# EAGLE design color_sensor (EAGLE 6.5.0)
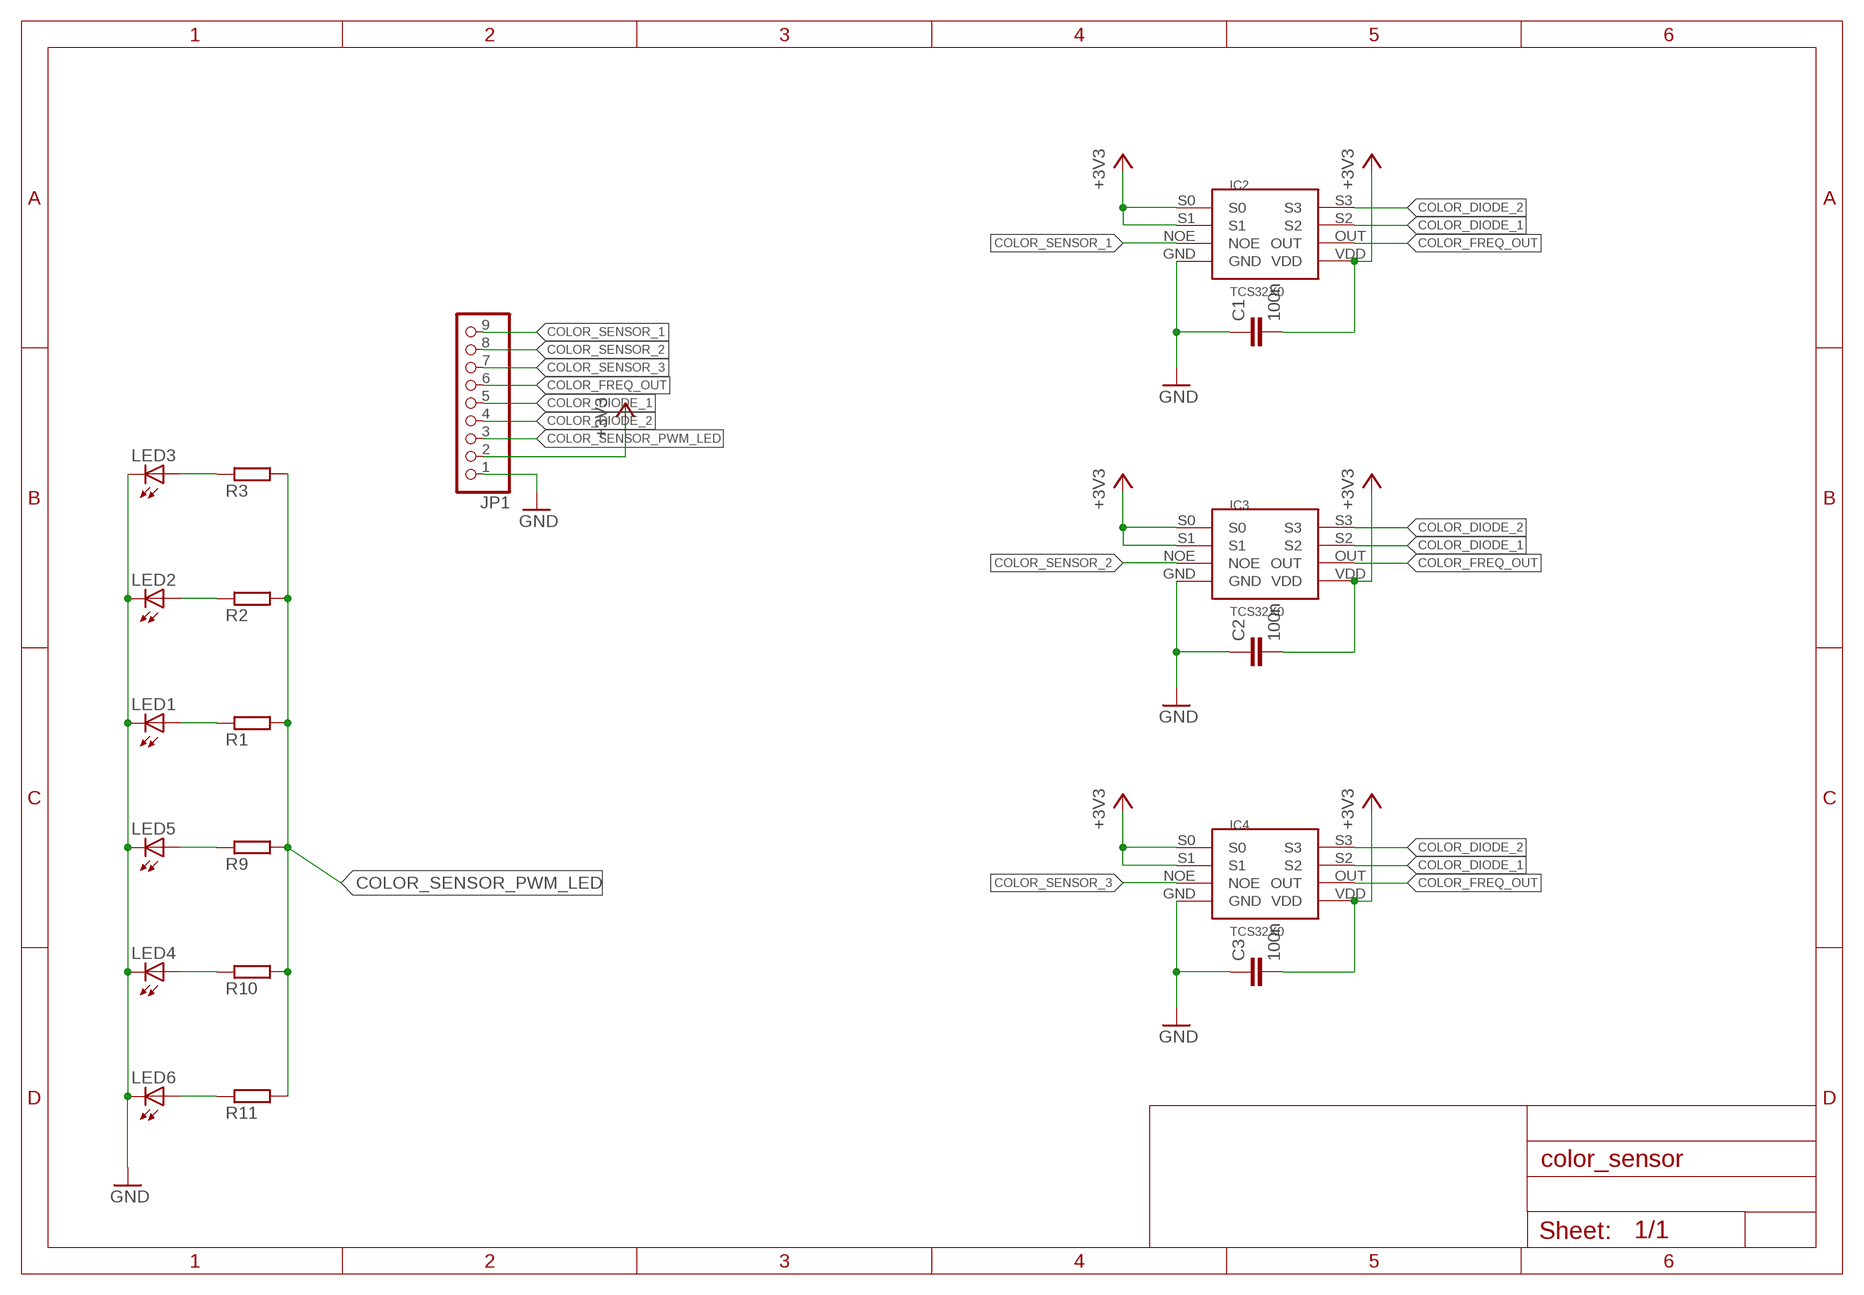
[diagram p0: schematic, sheet 1]

## Parts
C1  100n  C-EUC0805  [C0805]
C2  100n  C-EUC0805  [C0805]
C3  100n  C-EUC0805  [C0805]
IC2  TCS32X0  [TCS32X0]
IC3  TCS32X0  [TCS32X0]
IC4  TCS32X0  [TCS32X0]
JP1  PINHD-1X9  [1X09]
LED1  NFSG036BT  [NFSG036BT]
LED2  NFSG036BT  [NFSG036BT]
LED3  NFSG036BT  [NFSG036BT]
LED4  NFSG036BT  [NFSG036BT]
LED5  NFSG036BT  [NFSG036BT]
LED6  NFSG036BT  [NFSG036BT]
R1  R-EU_M0805  [M0805]
R2  R-EU_M0805  [M0805]
R3  R-EU_M0805  [M0805]
R9  R-EU_M0805  [M0805]
R10  R-EU_M0805  [M0805]
R11  R-EU_M0805  [M0805]

## Nets
+3V3: C1.2 C2.2 C3.2 IC2.S0 IC2.S1 IC2.VDD IC3.S0 IC3.S1 IC3.VDD IC4.S0 IC4.S1 IC4.VDD JP1.2
COLOR_DIODE_1: IC2.S2 IC3.S2 IC4.S2 JP1.5
COLOR_DIODE_2: IC2.S3 IC3.S3 IC4.S3 JP1.4
COLOR_FREQ_OUT: IC2.OUT IC3.OUT IC4.OUT JP1.6
COLOR_SENSOR_1: IC2.NOE JP1.9
COLOR_SENSOR_2: IC3.NOE JP1.8
COLOR_SENSOR_3: IC4.NOE JP1.7
COLOR_SENSOR_PWM_LED: JP1.3 R1.2 R2.2 R3.2 R9.2 R10.2 R11.2
GND: C1.1 C2.1 C3.1 IC2.GND IC3.GND IC4.GND JP1.1 LED1.C LED2.C LED3.C LED4.C LED5.C LED6.C
N$1: LED1.A R1.1
N$2: LED2.A R2.1
N$3: LED3.A R3.1
N$17: LED5.A R9.1
N$18: LED4.A R10.1
N$19: LED6.A R11.1

## Library data of the parts
C1-C3 = rcl:C-EU: CAPACITOR, European symbol
IC2-IC4 = BEEP:TCS32X0
JP1 = pinhead:PINHD-1X9: PIN HEADER
LED1-LED6 = led:NFSG036BT: CHIP TYPE GREEN LED NFSx036xT Source: NICHIA CORPORATION .. NFSG036BT-E.pdf
R1-R3 R9-R11 = rcl:R-EU_: RESISTOR, European symbol

## Board
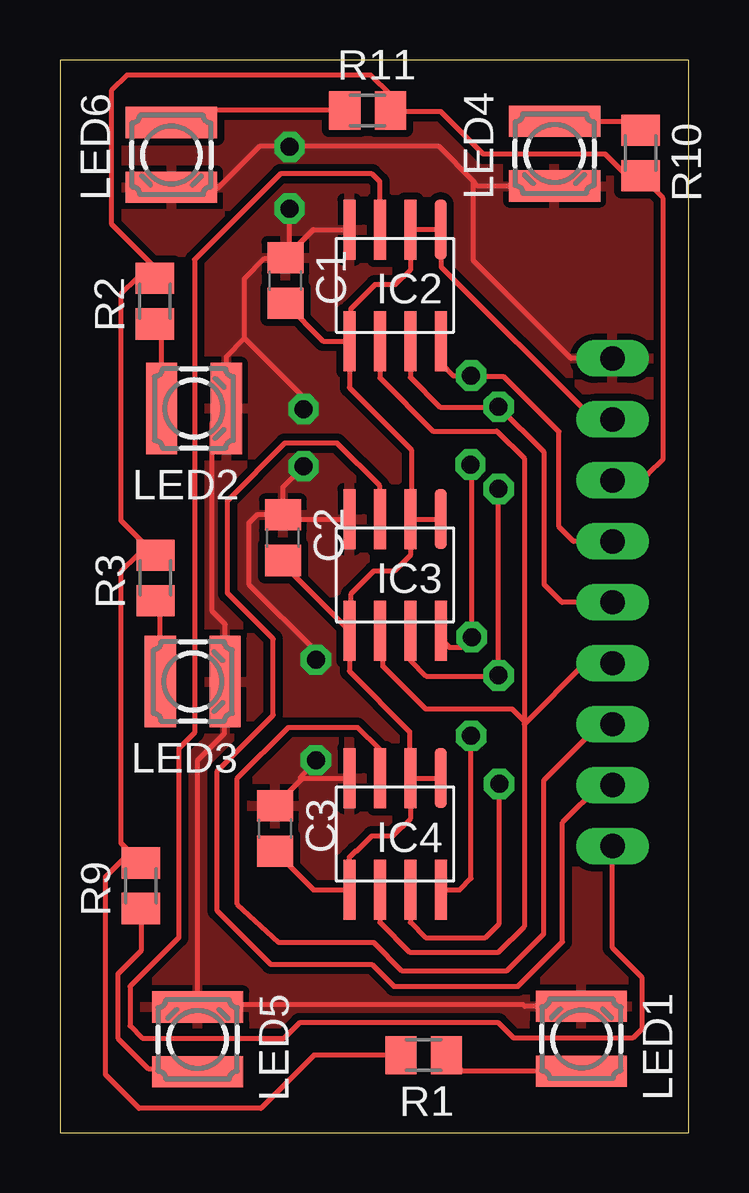
[diagram p1: board, top side]
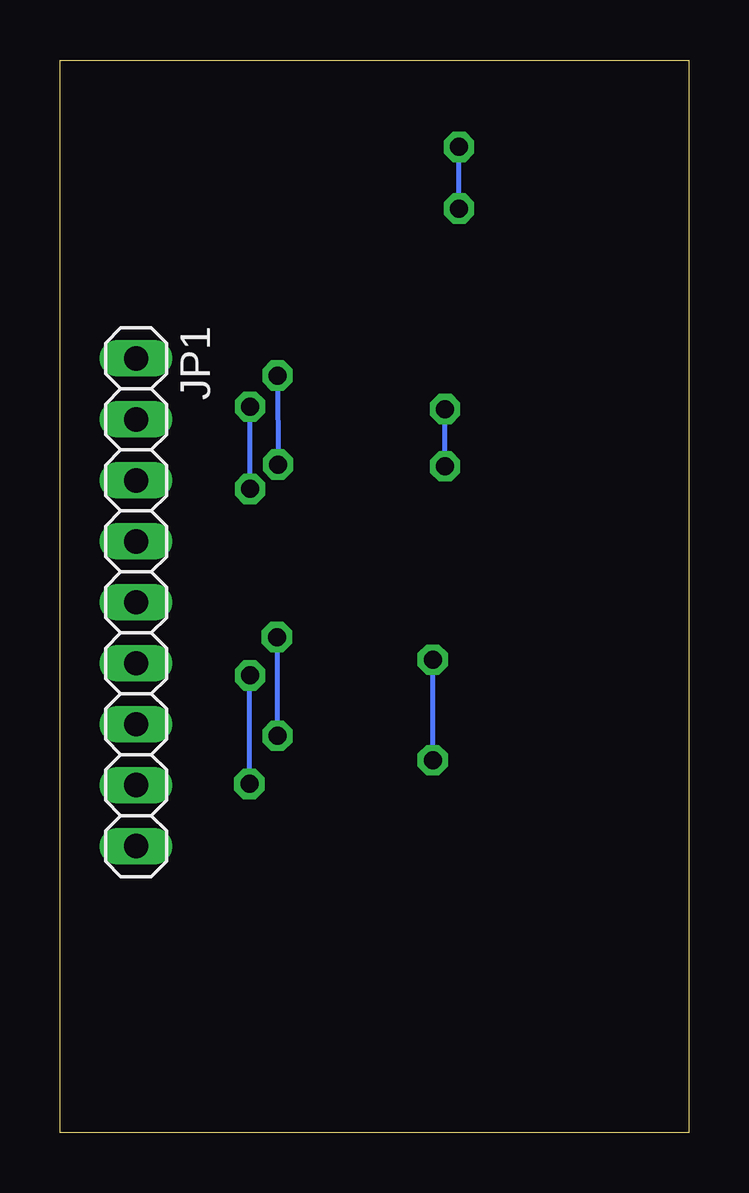
[diagram p2: board, bottom side, seen from below]

Size 26.21 x 44.69 mm. Coordinates in mm from the lower left corner, seen from the top.
Outline: 0,0 26.21,0 26.21,44.69 0,44.69 0,0
Copper layers (1*16): Top 0.035mm / dielectric 1.5mm / Bottom 0.035mm
Design rules "default *": minimum track width 8mil, minimum drill 0.75mm, track to track 8mil, track to pad 8mil, pad to pad 8mil, via to via 8mil, smd to smd 8mil, copper to edge 20mil, drill to drill 8mil, minimum pad ring 10mil, minimum via ring 10mil, stop-mask expansion 4mil, vias tented up to drill 0mil, thermal gap 10mil

### Footprints (pad centres in the part's own frame; a part is rotated, then mirrored left to right if it is on the bottom)
C0805 = smd 1.3 x 1.5: 1 -0.95,0; 2 0.95,0
TCS32X0 = smd 0.5 x 2.5: GND 1.905,-2.325; NOE 0.635,-2.325; OUT 0.635,2.325; S0 -1.905,-2.325; S1 -0.635,-2.325; S2 -0.635,2.325; S3 -1.905,2.325; VDD 1.905,2.325
1X09 = drill 1.016 long: 1 -10.16,0; 2 -7.62,0; 3 -5.08,0; 4 -2.54,0; 5 0,0; 6 2.54,0; 7 5.08,0; 8 7.62,0; 9 10.16,0
NFSG036BT = smd 1.3 x 3.8: A 1.35,0; C -1.35,0
M0805 = smd 1.3 x 1.6: 1 -0.95,0; 2 0.95,0

### Placement (x,y rotation side)
C1  9.4,35.51 270 top
C2  9.3,24.79 270 top
C3  8.97,12.67 270 top
IC2  13.97,35.31 180 top
IC3  13.97,23.24 180 top
IC4  13.97,12.45 180 top
JP1  23.04,22.1 270 bottom
LED1  21.74,3.91 270 top
LED2  5.59,30.18 180 top
LED3  5.54,18.8 180 top
LED4  20.62,40.79 90 top
LED5  5.74,3.89 270 top
LED6  4.65,40.74 90 top
R1  15.16,3.23 180 top
R2  3.96,34.65 90 top
R3  3.99,23.11 90 top
R9  3.38,10.29 90 top
R10  24.21,40.82 270 top
R11  12.83,42.6 0 top

### Tracks (layer width: path | path; a pad name or v marks a point on that pad's centre or on a via)
+3V3
  Top 0.203: IC2.VDD 12.06,31.04 14.66,28.45 14.66,25.62 IC3.S1 | IC3.S1 IC3.S0 | IC3.S1 14.61,24.05 13.95,23.39 13.08,23.39 12.12,22.43 12.12,20.97 IC3.VDD | IC3.VDD 12.06,19.23 14.58,16.71 14.58,14.8 IC4.S1 | IC4.S1 IC4.S0 | IC4.S1 14.63,14.75 14.63,13.11 13.89,12.37 13.01,12.37 12.37,11.73 12.32,11.73 12.06,11.48 IC4.VDD 10.57,10.12 C3.2 | C1.2 10.98,32.98 IC2.VDD | IC2.VDD 12.12,33.03 12.12,34.31 13.13,35.33 13.99,35.33 14.61,35.94 IC2.S1 IC2.S0 15.9,37.61 15.9,36.07 22.25,29.72 JP1.2 | C2.2 9.3,23.68 IC3.VDD
COLOR_DIODE_1  (via drill 0.75)
  Top 0.203: IC2.S2 14.61,31.47 15.85,30.23 18.26,30.23 v18.29,30.25 20.19,28.35 20.19,22.84 20.93,22.1 JP1.5 | IC3.S2 14.63,20.89 14.63,19.66 15.27,19.02 18.31,19.02 v18.29,19.05 v18.29,26.82 | IC4.S2 14.61,8.76 15.24,8.13 17.73,8.13 18.31,8.71 v18.31,14.53
  Bottom 0.203: v18.29,19.05 18.31,19.02 | 18.39,18.95 18.31,19.02 | v18.29,26.82 v18.29,30.25 | v18.31,14.53 18.31,19.02
COLOR_DIODE_2  (via drill 0.75)
  Top 0.203: IC2.S3 15.88,32.05 16.38,31.55 v17.14,31.55 17.2,31.5 18.52,31.5 20.8,29.21 20.8,25.25 21.41,24.64 JP1.4 | v17.12,27.84 17.17,27.84 v17.17,20.65 16.74,20.22 16.23,20.22 15.88,20.57 IC3.S3 | IC4.S3 16.67,10.12 17.14,10.59 v17.14,16.54
  Bottom 0.203: v17.14,31.55 v17.12,27.84 | v17.14,16.54 17.14,20.52 v17.17,20.65
COLOR_FREQ_OUT
  Top 0.203: IC2.OUT 13.34,31.45 15.54,29.23 18.21,29.23 19.36,28.09 19.36,17.14 | 19.36,17.14 19.36,17.02 | 19.36,17.02 19.36,8.58 18.29,7.52 14.58,7.52 13.34,8.76 IC4.OUT | IC3.OUT 13.46,20.79 13.46,19.43 15.24,17.65 18.85,17.65 19.36,17.14 | 19.36,17.02 21.89,19.56 JP1.6
COLOR_SENSOR_1
  Top 0.203: IC2.NOE 13.34,39.62 13.01,39.95 9.2,39.95 5.61,36.37 5.61,16.66 4.95,16 4.95,8.13 2.92,6.1 2.92,4.45 3.43,3.94 9.35,3.94 9.98,4.57 18.29,4.57 18.92,3.94 23.88,3.94 24.26,4.32 24.26,6.48 23.04,7.7 JP1.9
COLOR_SENSOR_2
  Top 0.203: IC3.NOE 13.34,26.95 11.56,28.73 9.37,28.73 6.99,26.34 6.99,22.48 8.89,20.57 8.89,17.4 6.55,15.06 6.55,9.25 8.79,7.01 13.01,7.01 13.92,6.1 19.1,6.1 20.95,7.95 20.95,12.93 22.5,14.48 JP1.8
COLOR_SENSOR_3
  Top 0.203: IC4.NOE 13.34,15.95 12.39,16.89 9.53,16.89 7.39,14.76 7.39,9.53 9.12,7.93 13.08,7.93 14.25,6.76 18.64,6.76 20.17,8.28 20.17,14.68 22.5,17.02 JP1.7
COLOR_SENSOR_PWM_LED
  Top 0.203: 2.93,11.69 2.54,12.07 2.54,23.37 3.24,24.06 R3.2 2.54,25.51 2.54,34.92 3.21,35.6 R2.2 3.96,36.04 2.16,37.85 2.16,43.43 2.79,44.07 12.95,44.07 13.78,43.25 R11.2 13.83,42.55 15.88,42.55 17.65,40.77 22.73,40.77 23.63,39.87 R10.2 25.15,38.93 25.15,28.07 24.51,27.43 24.26,27.18 JP1.3 | 2.93,11.69 R9.2 | R1.2 10.59,3.23 8.38,1.02 3.3,1.02 1.91,2.41 1.91,10.67 2.93,11.69
GND  (via drill 0.75)
  Top 0.203: C3.1 10.11,14.77 | 10.11,14.77 IC4.GND | IC3.GND 10.01,25.57 10.01,25.56 | 10.57,37.63 C1.1 9.36,36.42 8.53,36.42 7.7,35.59 7.7,33.1 | 10.57,37.63 IC2.GND | 10.11,14.77 10.02,14.77 v10.67,15.52 | 10.57,37.63 10.55,37.63 9.58,36.65 v9.58,38.51 | 17.25,39.65 17.25,36.32 21.31,32.26 JP1.1 | 17.25,39.65 15.8,41.1 9.6,41.1 | 9.6,41.1 v9.58,41.07 | LED4.C 17.42,39.44 17.25,39.65 | v10.67,19.71 10.67,20.07 7.87,22.86 7.87,25.4 8.21,25.74 C2.1 9.3,26.9 v10.16,27.76 | v10.16,30.15 10.16,30.63 7.7,33.1 | 7.7,33.1 6.94,32.34 LED2.C 6.35,29.59 6.35,21.72 6.89,21.18 LED3.C 6.86,18.77 6.86,16.64 5.74,15.52 LED5.C 5.84,5.33 19.3,5.33 19.38,5.26 LED1.C | 9.6,41.1 8.33,41.1 6.6,39.37 4.67,39.37 LED6.C
  Bottom 0.203: v10.67,15.52 v10.67,19.71 | v10.16,27.76 v10.16,30.15 | v9.58,38.51 v9.58,41.07
  pour Top (isolate 0.305): -7.75,49.53 32.89,49.53 32.89,-3.68 -7.75,-3.68
N$1
  Top 0.203: LED1.A 16.78,2.56 R1.1
N$2
  Top 0.203: LED2.A 4.24,33.42 R2.1
N$3
  Top 0.203: LED3.A 4.19,21.96 R3.1
N$17
  Top 0.203: R9.1 3.38,7.57 2.41,6.6 2.41,3.94 3.68,2.67 5.61,2.67 LED5.A
N$18
  Top 0.203: LED4.A 23.83,42.14 R10.1
N$19
  Top 0.203: R11.1 5.15,42.6 LED6.A